# EAGLE design preamp (EAGLE 5.11)
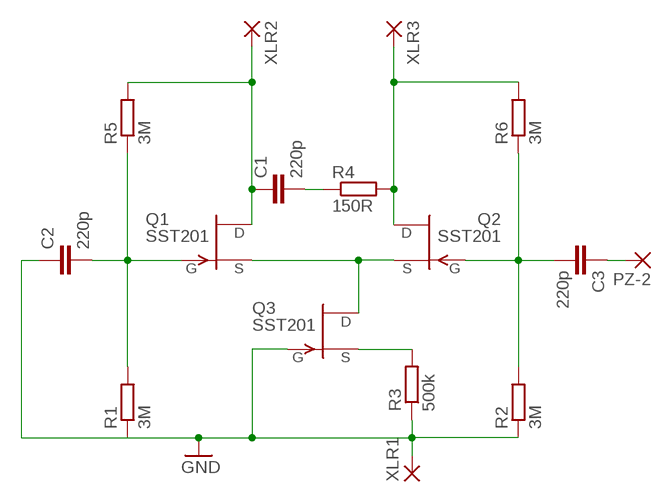
[diagram p0: schematic, sheet 1]

## Parts
C1  220p  C-EUC1206  [C1206]
C2  220p  C-EUC1206  [C1206]
C3  220p  C-EUC1206  [C1206]
PZ-2  3,17/1,3  [3,17/1,3]
Q1  SST201  [SOT23]
Q2  SST201  [SOT23]
Q3  SST201  [SOT23]
R1  3M  R-EU_R1206  [R1206]
R2  3M  R-EU_R1206  [R1206]
R3  500k  R-EU_R1206  [R1206]
R4  150R  R-EU_R1206  [R1206]
R5  3M  R-EU_R1206  [R1206]
R6  3M  R-EU_R1206  [R1206]
XLR1  3,17/1,3  [3,17/1,3]
XLR2  3,17/1,3  [3,17/1,3]
XLR3  3,17/1,3  [3,17/1,3]

## Nets
GND: C2.1 Q3.3(G) R1.1 R2.1 R3.1 XLR1.1(P)
N$1: Q1.2(S) Q2.2(S) Q3.1(D)
N$3: C2.2 Q1.3(G) R1.2 R5.1
N$5: C1.2 R4.1
N$6: C3.1 PZ-2.1(P)
N$7: C3.2 Q2.3(G) R2.2 R6.1
N$9: Q3.2(S) R3.2
XLR3: Q2.1(D) R4.2 R6.2 XLR3.1(P)
XLR-2: C1.1 Q1.1(D) R5.2 XLR2.1(P)

## Library data of the parts
C1-C3 = rcl:C-EU: CAPACITOR, European symbol
PZ-2 XLR1-XLR3 = wirepad:3,17/1,3: THROUGH-HOLE PAD
Q1-Q3 = transistor-fet:?20*: TEMIC / Siliconix N-Channel JFET Source: JFET-J201_Siliconix_data.pdf
R1-R6 = rcl:R-EU_: RESISTOR, European symbol

## Board
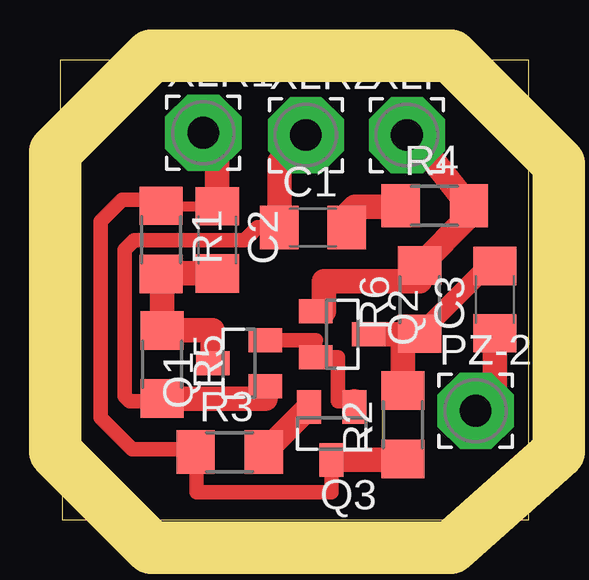
[diagram p1: board, top side]

Size 19.55 x 19.16 mm. Coordinates in mm from the lower left corner, seen from the top.
Outline: 0.1,0 19.55,0 19.55,19.16 0,19.16 0.1,0
Copper layers (1*16): Top 0.035mm / dielectric 1.5mm / Bottom 0.035mm
Design rules "default": minimum track width 10mil, minimum drill 24mil, track to track 8mil, track to pad 8mil, pad to pad 8mil, via to via 8mil, smd to smd 8mil, copper to edge 40mil, drill to drill 8mil, minimum pad ring 10mil, minimum via ring 8mil, stop-mask expansion 4mil, vias tented up to drill 0mil, thermal gap 10mil
Milling: 8 lines

### Footprints (pad centres in the part's own frame; a part is rotated, then mirrored left to right if it is on the bottom)
C1206 = smd 1.6 x 1.8: 1 -1.4,0; 2 1.4,0
3,17/1,3 = drill 1.321 pad 3.175 octagon: 1 0,0
SOT23 = smd 1 x 1.4: 1 -0.95,-1.1; 2 0.95,-1.1; 3 0,1.1
R1206 = smd 1.6 x 1.803: 1 -1.422,0; 2 1.422,0

### Placement (x,y rotation side)
C1  10.55,12.18 0 top
C2  6.56,11.66 270 top
C3  18.14,9.17 90 top
PZ-2  17.34,4.54 0 top
Q1  7.47,6.52 90 top
Q2  11.77,7.73 270 top
Q3  11.33,3.59 180 top
R1  4.22,11.66 270 top
R2  14.3,3.95 90 top
R3  7.08,2.82 0 top
R4  15.63,13.08 0 top
R5  4.26,6.47 270 top
R6  15,9.17 90 top
XLR1  5.98,16.12 0 top
XLR2  10.25,16.03 0 top
XLR3  14.47,16.03 0 top

### Tracks (layer width: path | path; a pad name or v marks a point on that pad's centre or on a via)
GND
  Top 0.406: C2.1 4.22,13.06 R1.1 | 14.3,2.49 R2.1 | 5.66,2.94 R3.1 5.7,2.82 | 6.56,16.12 XLR1.1
  Top 0.61: 5.7,2.82 5.7,1.14 11.33,1.14 Q3.3 | R1.1 3.96,13.34 2.6,13.34 1.7,12.44 1.7,4.24 3,2.94 5.66,2.94
  Top 1.016: Q3.3 14.3,2.49 | C2.1 6.56,16.12
N$1
  Top 0.5: 10.67,7.47 Q2.2
  Top 0.61: Q1.2 10.67,7.47 | Q2.2 11.6,6.78 11.6,4.94 12.28,4.94
  Top 1.016: 12.28,4.94 Q3.1
N$3
  Top 0.5: 4.22,10.26 R1.2 4.26,10.24
  Top 1.016: 4.22,10.26 C2.2 | 4.26,10.24 R5.1 6.37,7.89 Q1.3
N$5
  Top 0.61: C1.2 11.95,12.69 | 14.17,13.04 R4.1
  Top 1.016: 11.95,12.69 12.3,13.04 14.17,13.04
N$6
  Top 1.016: C3.1 18.14,5.35 PZ-2.1
N$7
  Top 0.406: 14.3,7.75 R6.1
  Top 0.5: 15,8.07 R6.1 15,7.73
  Top 0.813: C3.2 17.82,10.57 R6.1
  Top 1.016: 15,7.73 Q2.3 | R2.2 14.3,7.75
N$9
  Top 0.406: R3.2
  Top 1.016: R3.2 Q3.2
XLR3
  Top 0.5: Q2.1 11,8.68 | 15,9.94 R6.2 | 15.45,15.12 XLR3.1
  Top 1.016: 11,8.68 11,9.94 15,9.94 | 15.45,15.12 R4.2 17.05,12.64 R6.2
XLR-2
  Top 0.5: R5.2 4.26,4.94 | 8.57,5.05 Q1.1
  Top 0.61: 4.26,4.94 2.9,4.94 2.7,5.14 2.7,11.24 3.1,11.64 7.7,11.64 8.24,12.18 C1.1 | 9.15,14.92 XLR2.1
  Top 1.016: R5.2 8.57,5.05 | C1.1 9.15,14.92